# EAGLE design amp (EAGLE 5.07)
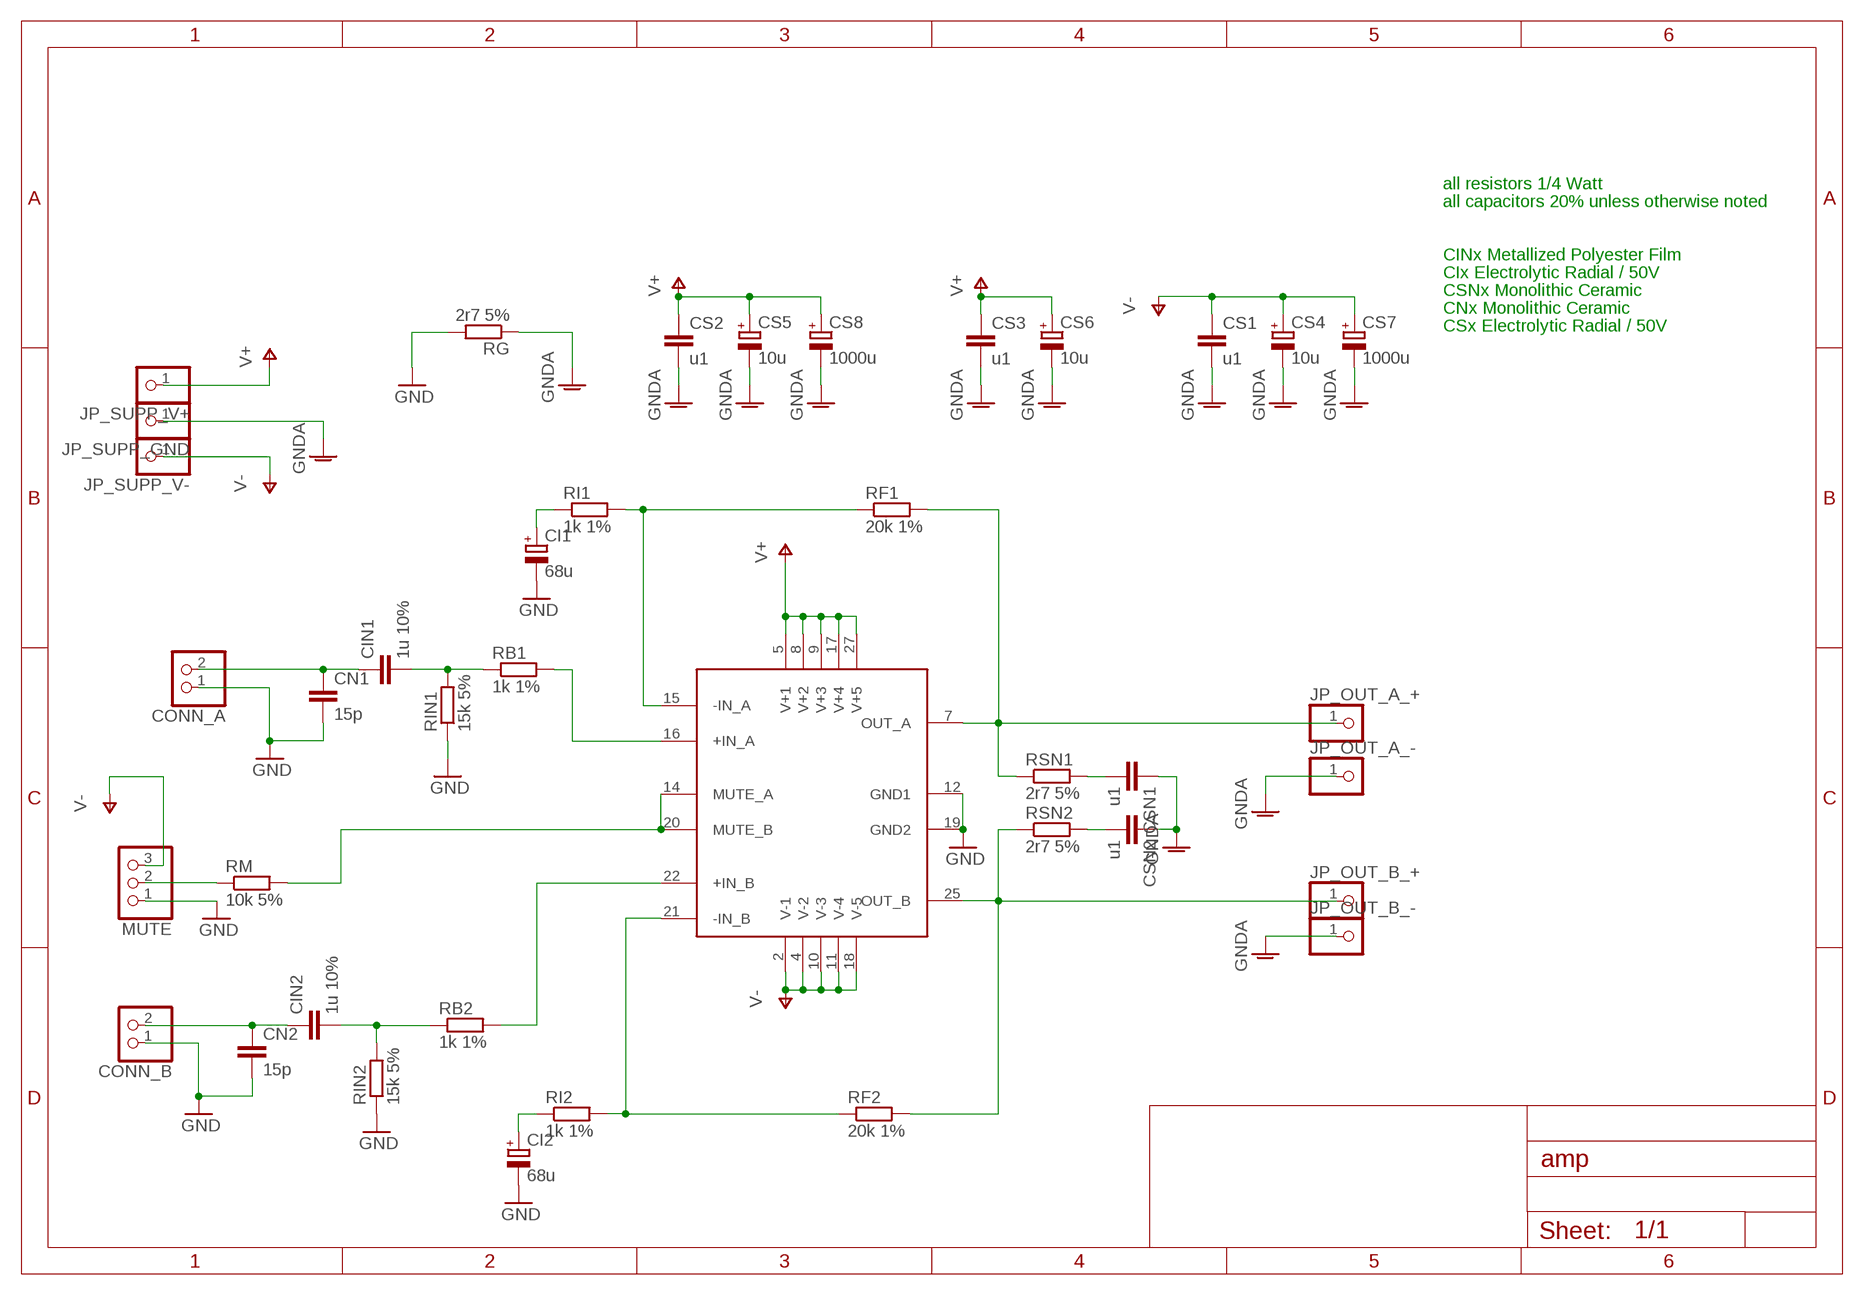
[diagram p0: schematic, sheet 1]

## Parts
CI1  68u  CPOL-EUE2.5-7  [E2,5-7]
CI2  68u  CPOL-EUE2.5-7  [E2,5-7]
CIN1  1u 10%  C-EU050-025X075  [C050-025X075]
CIN2  1u 10%  C-EU050-025X075  [C050-025X075]
CN1  15p  C-EU050-024X044  [C050-024X044]
CN2  15p  C-EU050-024X044  [C050-024X044]
CONN_A  PINHD-1X2  [1X02]
CONN_B  PINHD-1X2  [1X02]
CS1  u1  C-EU025-030X050  [C025-030X050]
CS2  u1  C-EU025-030X050  [C025-030X050]
CS3  u1  C-EU025-030X050  [C025-030X050]
CS4  10u  CPOL-EUE2-5  [E2-5]
CS5  10u  CPOL-EUE2-5  [E2-5]
CS6  10u  CPOL-EUE2-5  [E2-5]
CS7  1000u  CPOL-EUE5-13  [E5-13]
CS8  1000u  CPOL-EUE5-13  [E5-13]
CSN1  u1  C-EU025-030X050  [C025-030X050]
CSN2  u1  C-EU025-030X050  [C025-030X050]
JP_OUT_A_+  PINHD-1X1  [1X01]
JP_OUT_A_-  PINHD-1X1  [1X01]
JP_OUT_B_+  PINHD-1X1  [1X01]
JP_OUT_B_-  PINHD-1X1  [1X01]
JP_SUPP_GND  PINHD-1X1  [1X01]
JP_SUPP_V+  PINHD-1X1  [1X01]
JP_SUPP_V-  PINHD-1X1  [1X01]
MUTE  PINHD-1X3  [1X03]
RB1  1k 1%  R-EU_0204/7  [0204/7]
RB2  1k 1%  R-EU_0204/7  [0204/7]
RF1  20k 1%  R-EU_0204/7  [0204/7]
RF2  20k 1%  R-EU_0204/7  [0204/7]
RG  2r7 5%  R-EU_0204/7  [0204/7]
RI1  1k 1%  R-EU_0204/7  [0204/7]
RI2  1k 1%  R-EU_0204/7  [0204/7]
RIN1  15k 5%  R-EU_0207/7  [0207/7]
RIN2  15k 5%  R-EU_0204/7  [0204/7]
RM  10k 5%  R-EU_0204/5  [0204/5]
RSN1  2r7 5%  R-EU_0204/5  [0204/5]
RSN2  2r7 5%  R-EU_0204/5  [0204/5]
U$1  L4780TA  LM4780TA  [TO-220_27]

## Nets
GND [low_gnd]: CI1.- CI2.- CN1.2 CN2.2 CONN_A.1 CONN_B.1 MUTE.1 RG.2 RIN1.1 RIN2.1 U$1.12(GND1) U$1.19(GND2)
GNDA [power]: CS1.2 CS2.2 CS3.2 CS4.- CS5.- CS6.- CS7.- CS8.- CSN1.1 CSN2.1 JP_OUT_A_-.1 JP_OUT_B_-.1 JP_SUPP_GND.1 RG.1
N$1: MUTE.2 RM.1
N$3 [audio_in]: CIN1.2 RB1.1 RIN1.2
N$4 [audio_in]: CIN1.1 CN1.1 CONN_A.2
N$5 [audio_in]: RB1.2 U$1.16(+IN_A)
N$6 [audio_in]: CIN2.2 RB2.1 RIN2.2
N$7 [audio_in]: CIN2.1 CN2.1 CONN_B.2
N$9: CSN1.2 RSN1.2
N$11: CI2.+ RI2.1
N$12: RF2.1 RI2.2 U$1.21(-IN_B)
N$14: CSN2.2 RSN2.2
N$17: CI1.+ RI1.1
N$18: RF1.1 RI1.2 U$1.15(-IN_A)
N_AUDIO_IN_B [audio_in]: RB2.2 U$1.22(+IN_B)
N_MUTE: RM.2 U$1.14(MUTE_A) U$1.20(MUTE_B)
N_OUT_A [audio_out]: JP_OUT_A_+.1 RF1.2 RSN1.1 U$1.7(OUT_A)
N_OUT_B [audio_out]: JP_OUT_B_+.1 RF2.2 RSN2.1 U$1.25(OUT_B)
V+ [power]: CS2.1 CS3.1 CS5.+ CS6.+ CS8.+ JP_SUPP_V+.1 U$1.5(V+1) U$1.8(V+2) U$1.9(V+3) U$1.17(V+4) U$1.27(V+5)
V- [power]: CS1.1 CS4.+ CS7.+ JP_SUPP_V-.1 MUTE.3 U$1.2(V-1) U$1.4(V-2) U$1.10(V-3) U$1.11(V-4) U$1.18(V-5)

## Notes on the sheet
- all resistors 1/4 Watt
- all capacitors 20% unless otherwise noted
- CINx Metallized Polyester Film
- CIx Electrolytic Radial / 50V
- CSNx Monolithic Ceramic
- CNx Monolithic Ceramic
- CSx Electrolytic Radial / 50V

## Library data of the parts
CI1 CI2 CS4-CS8 = resistor:CPOL-EU: POLARIZED CAPACITOR, European symbol
CIN1 CIN2 CN1 CN2 CS1-CS3 CSN1 CSN2 = resistor:C-EU: CAPACITOR, European symbol
CONN_A CONN_B = pinhead:PINHD-1X2: PIN HEADER
JP_OUT_A_+ JP_OUT_A_- JP_OUT_B_+ JP_OUT_B_- JP_SUPP_GND JP_SUPP_V+ JP_SUPP_V- = pinhead:PINHD-1X1: PIN HEADER
MUTE = pinhead:PINHD-1X3: PIN HEADER
RB1 RB2 RF1 RF2 RG RI1 RI2 RIN1 RIN2 RM RSN1 RSN2 = resistor:R-EU_: RESISTOR, European symbol
U$1 = mru-lib:LM4780TA: National Semiconductor LM4780 Overture Audio Power Amplifier Series TO220 27 Lead Package

## Net classes
1 power: width 1.778 mm
2 audio_in: width 0.508 mm
3 audio_out: width 1.27 mm

## Board
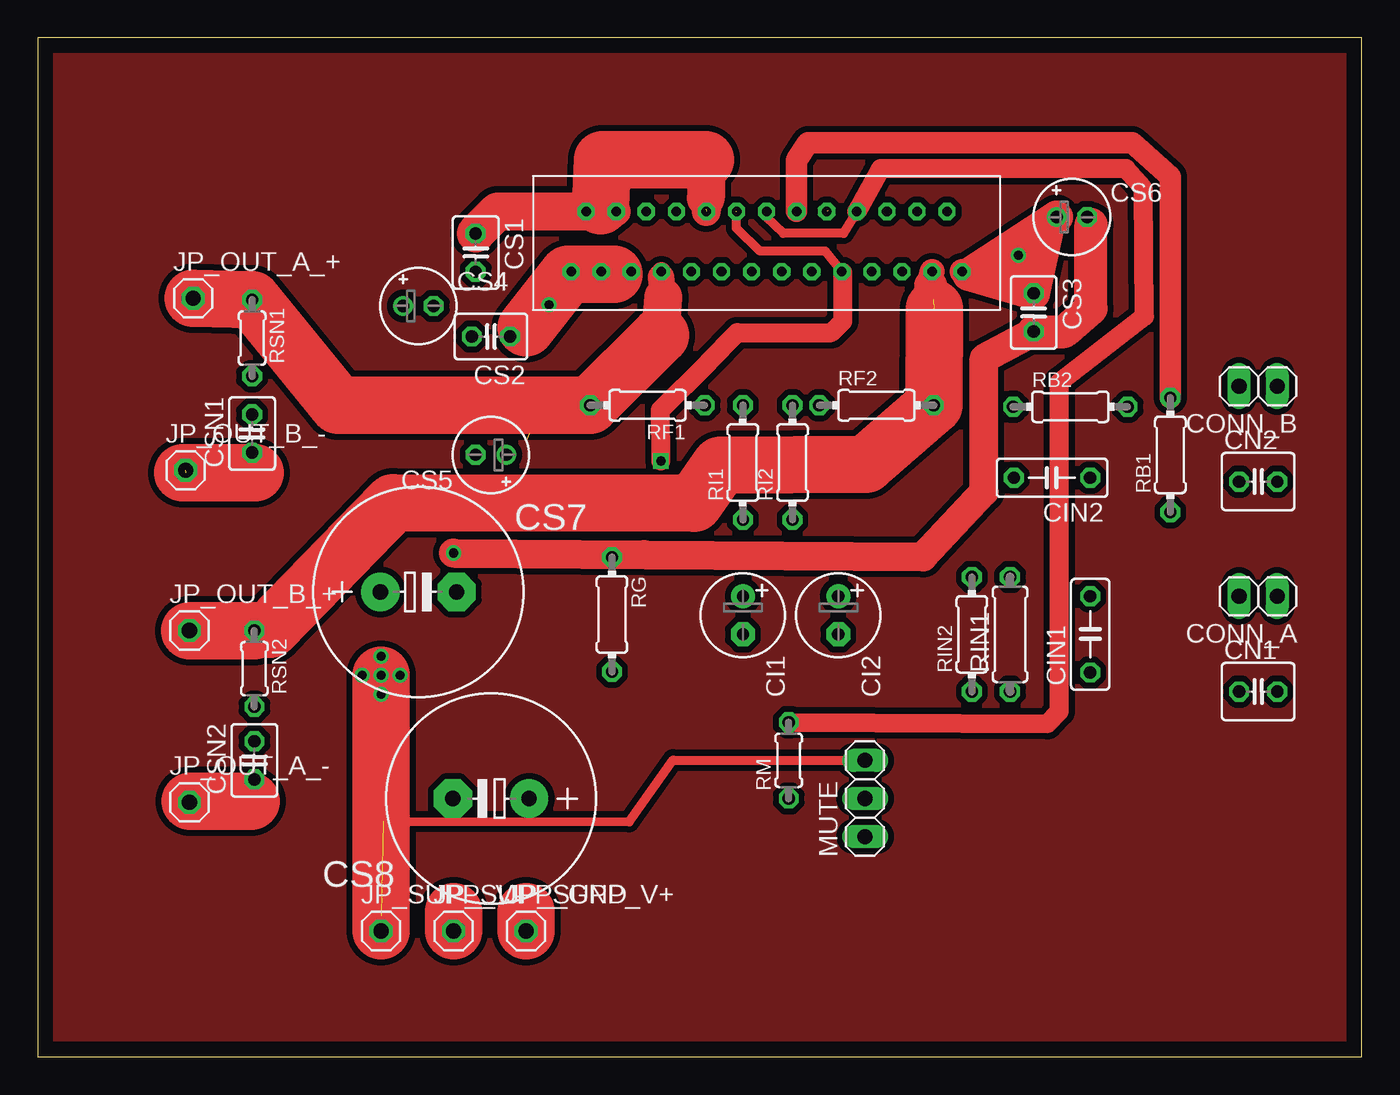
[diagram p1: board, top side]
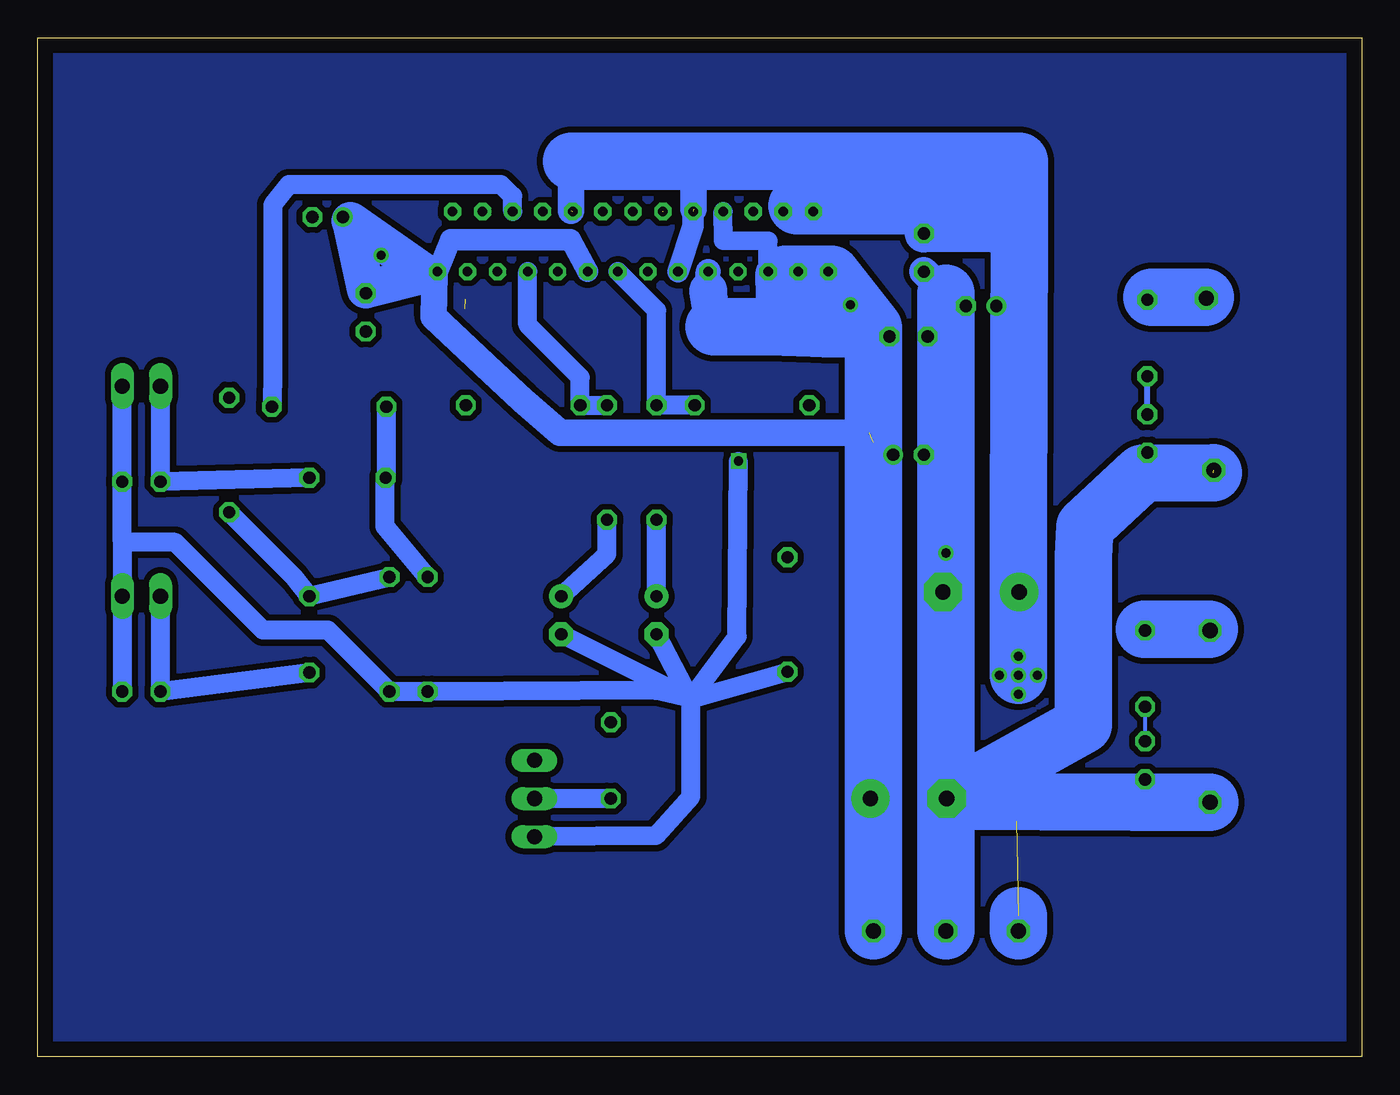
[diagram p2: board, bottom side, seen from below]

Size 88.14 x 67.82 mm. Coordinates in mm from the lower left corner, seen from the top.
Outline: 0,0 88.14,0 88.14,67.82 0,67.82 0,0
Copper layers (1*16): Top 0.035mm / dielectric 1.5mm / Bottom 0.035mm
Design rules "default": minimum track width 10mil, minimum drill 24mil, track to track 8mil, track to pad 8mil, pad to pad 8mil, via to via 8mil, smd to smd 8mil, copper to edge 40mil, drill to drill 8mil, minimum pad ring 10mil, minimum via ring 8mil, stop-mask expansion 4mil, vias tented up to drill 0mil, thermal gap 10mil

### Footprints (pad centres in the part's own frame; a part is rotated, then mirrored left to right if it is on the bottom)
E2,5-6 = drill 0.813 pad 1.6 round: + -1.27,0 | drill 0.813 pad 1.6 octagon: - 1.27,0
C050-025X075 = drill 0.813 octagon: 1 -2.54,0; 2 2.54,0
C025-040X050 = drill 0.813 octagon: 1 -1.27,0; 2 1.27,0
1X02 = drill 1.016 long: 1 -1.27,0; 2 1.27,0
C025-030X050 = drill 0.813 octagon: 1 -1.27,0; 2 1.27,0
E2-5 = drill 0.813 pad 1.27 round: + -1.016,0 | drill 0.813 pad 1.27 octagon: - 1.016,0
E5-13 = drill 1.016 pad 2.54 round: + -2.54,0 | drill 1.016 pad 2.54 octagon: - 2.54,0
1X01 = drill 1.016 octagon: 1 0,0
1X03 = drill 1.016 long: 1 -2.54,0; 2 0,0; 3 2.54,0
0204/7 = drill 0.813 octagon: 1 -3.81,0; 2 3.81,0
0207/7 = drill 0.813 octagon: 1 -3.81,0; 2 3.81,0
0204/5 = drill 0.813 octagon: 1 -2.54,0; 2 2.54,0
TO-220_27 = drill 0.635 octagon: 1 0,0; 2 1.001,4.003; 3 2.002,0; 4 3.002,4.003; 5 4.003,0; 6 5.004,4.003; 7 6.005,0; 8 7.005,4.003; 9 8.006,0; 10 9.007,4.003; 11 10.008,0; 12 11.008,4.003; 13 12.009,0; 14 13.01,4.003; 15 14.011,0; 16 15.011,4.003; 17 16.012,0; 18 17.013,4.003; 19 18.014,0; 20 19.014,4.003; 21 20.015,0; 22 21.016,4.003; 23 22.017,0; 24 23.017,4.003; 25 24.018,0; 26 25.019,4.003; 27 26.015,0

### Placement (x,y rotation side)
CI1  68u  [E2,5-6]  46.94,29.39 270 top
CI2  68u  [E2,5-6]  53.29,29.39 270 top
CIN1  70.05,28.12 90 top
CIN2  67.51,38.53 180 top
CN1  15p  [C025-040X050]  81.23,24.31 0 top
CN2  15p  [C025-040X050]  81.23,38.28 0 top
CONN_A  81.23,30.66 180 top
CONN_B  81.23,44.63 180 top
CS1  29.16,53.52 270 top
CS2  30.18,47.93 180 top
CS3  66.29,49.53 270 top
CS4  25.35,49.96 0 top
CS5  30.18,40.06 180 top
CS6  68.83,55.88 0 top
CS7  25.35,30.94 0 top
CS8  30.18,17.2 180 top
CSN1  14.27,41.48 90 top
CSN2  14.43,19.74 90 top
JP_OUT_A_+  10.36,50.47 0 top
JP_OUT_A_-  10.11,16.94 0 top
JP_OUT_B_+  10.11,28.37 0 top
JP_OUT_B_-  9.86,39.04 0 top
JP_SUPP_GND  27.69,8.38 0 top
JP_SUPP_V+  32.51,8.38 0 top
JP_SUPP_V-  22.86,8.38 0 top
MUTE  55.07,17.2 90 top
RB1  75.39,40.06 90 top
RB2  68.73,43.26 0 top
RF1  40.59,43.36 180 top
RF2  55.83,43.36 0 top
RG  38.23,29.44 270 top
RI1  46.94,39.55 90 top
RI2  50.24,39.55 90 top
RIN1  64.72,28.12 90 top
RIN2  62.18,28.12 90 top
RM  49.99,19.74 90 top
RSN1  14.27,47.83 270 top
RSN2  14.43,25.83 270 top
U$1  35.51,52.25 0 top

### Tracks (layer width: path | path; a pad name or v marks a point on that pad's centre or on a via)
GND  (via drill 0.6)  (1 unrouted)
  Top 0.406: 49.43,48.16 46.53,48.16 46.56,48.18 | 53.59,52.18 U$1.19
  Top 0.61: U$1.19 52.43,53.62 48.08,53.62 46.51,55.14 46.51,56.24
  Top 1.27: 46.53,48.16 44.63,46.18 41.45,43.05 v41.48,39.65 | 46.56,48.18 52.83,48.18 53.59,48.95 53.59,52.18
  Bottom 0.406: 82.45,34.24 82.5,34.29 | 41.5,39.62 v41.48,39.65
  Bottom 0.61: 44.65,23.8 44.68,23.8 44.68,23.85
  Bottom 1.27: CN1.2 CONN_A.1 82.5,34.29 CN2.2 CONN_B.1 | 44.68,23.8 CI1.- | 44.68,23.8 RG.2 | MUTE.1 46.99,14.73 44.65,17.32 44.65,23.8 CI2.- | 44.68,23.85 46.99,24.38 RIN2.1 RIN1.1 68.81,28.4 73.13,28.4 78.97,34.24 82.45,34.24 | 44.68,23.8 41.58,27.96 41.5,39.62
GNDA  (via drill 0.6)  (1 unrouted)
  Top 0.61: 70.1,55.37 CS6.- | 40.39,33.42 RG.1
  Top 1.93: CS3.2 62.99,46.48 62.99,37.59 58.93,33.27 40.39,33.42 v27.69,33.53
  Top 2.184: CS3.2 68.33,48.26 70.1,49.78 70.1,55.37
  Top 3.81: JP_SUPP_GND.1 27.69,9.65
  Bottom 0.406: 27.69,40.64 CS5.- | 27.69,31.75 CS7.- | 27.69,21.08 CS8.- | 14.48,16.94 CSN2.1
  Bottom 0.61: JP_OUT_B_-.1 CSN1.1 | 27.69,50.29 CS4.- | 27.69,49.78 CS2.2
  Bottom 1.93: 27.69,50.8 CS1.2
  Bottom 3.81: 9.91,38.86 14.63,38.84 18.44,35.28 18.54,33.27 18.54,22.1 27.69,17.02 | 27.69,17.02 JP_SUPP_GND.1 | 27.69,17.02 27.69,21.08 27.69,31.75 v27.69,33.53 27.69,40.64 27.69,49.78 27.69,50.29 27.69,50.8 | JP_OUT_A_-.1 14.48,16.94 15.16,16.94 27.69,17.02
N$1
  Bottom 1.27: RM.1 MUTE.2
N$2
  Bottom 3.81: 22.86,56.64 37.59,56.64
N$3
  Bottom 1.27: RIN1.2 CIN1.2 71.07,31.93 RB1.1
N$4
  Bottom 1.27: CONN_A.2 CN1.1 CIN1.1
N$5
  Top 1.422: RB1.2 75.39,58.57 72.87,60.83 51.28,60.83 50.52,59.66 U$1.16
N$6
  Bottom 1.27: RIN2.2 65.02,35.31 65.02,38.53 CIN2.2 64.92,38.48 RB2.1
N$7
  Bottom 1.27: CONN_B.2 CN2.1 CIN2.1
N$8
  Top 3.81: 32.51,48.51 35.31,52.07 38.35,52.07
N$9
  Bottom 0.406: CSN1.2 RSN1.2
N$10
  Bottom 2.54: 62.23,52.07 67.31,55.63 66.29,51.05 62.23,52.07
N$11
  Bottom 1.27: CI2.+ 50.24,33.45 RI2.1
N$12
  Bottom 1.27: U$1.21 55.52,48.72 52.02,45.21 RF2.1 RI2.2
N$13
  Bottom 3.81: 32.51,48.51 35.31,52.07 38.35,52.07
N$14
  Bottom 0.254: CSN2.2 RSN2.2
N$15  (via drill 0.6)
  other vias: 34.04,50.04
N$16  (via drill 0.6)
  other vias: 65.28,53.34
N$17
  Bottom 1.27: CI1.+ RI1.1
N$18
  Bottom 1.27: RF1.1 RI1.2 46.94,49.67 U$1.15
N$19  (via drill 0.6)
  other vias: 24.13,25.4
N$20  (via drill 0.6)
  other vias: 21.59,25.4
N$21  (via drill 0.6)
  other vias: 22.86,26.67
N$22
  Bottom 3.81: 10.41,50.55 13.97,50.55
N$23
  Bottom 3.81: 10.16,28.45 14.48,28.45
N$24
  Top 3.81: 9.65,38.86 14.48,38.86
N$25
  Top 3.81: 10.16,17.02 14.22,17.02
N$26
  pour Bottom (isolate 0.406, no thermals): 0.25,67.56 87.88,67.56 87.88,0.25 0.25,0.25
N$27
  pour Top (isolate 0.406, no thermals): 0.25,67.56 0.25,0.25 87.88,0.25 87.88,67.56
N_AUDIO_IN_B
  Bottom 1.27: U$1.22 56.52,57.28 57.3,58.04 71.42,58.04 72.49,56.69 72.49,45.74 RB2.2
N_MUTE
  Top 0.61: U$1.14 48.51,55.88 49.63,54.79 53.65,54.79 U$1.20
  Top 1.27: U$1.20 56.11,59.11 72.44,59.11 73.58,57.78 73.66,49.28 68,44.88 68,22.99 67.21,22.17 RM.2
N_OUT_A
  Top 1.27: 41.48,51.87 U$1.7
  Top 1.778: 41.66,50.55 41.48,51.87
  Top 2.54: 41.45,48.01 41.66,50.55
  Top 3.81: JP_OUT_A_+.1 RSN1.1 20.02,43.36 RF1.2 41.45,48.01
N_OUT_B  (1 unrouted)
  Top 1.676: 59.44,51.31 U$1.25
  Top 2.184: 59.66,50.42 59.44,51.31 | RSN2.1 15.49,28.45
  Top 3.81: JP_OUT_B_+.1 RSN2.1 | 15.49,28.45 23.67,36.88 43.69,36.83 45.47,39.37 55.14,39.42 RF2.2 59.69,49.78
V+  (1 unrouted)
  Top 1.422: 64.85,52.25 CS3.1
  Top 1.676: U$1.27 61.98,52.07
  Top 2.184: 67.31,55.37 66.29,54.61 CS3.1 | 67.31,55.37 CS6.+ 61.98,52.07 | 61.98,52.07 64.85,52.25 | 61.98,52.07 CS3.1 | CS3.1 67.31,55.37
  Top 3.81: 32.51,9.65 JP_SUPP_V+.1
  Bottom 0.406: 32.51,40.89 CS5.+ | 32.51,21.08 CS8.+
  Bottom 0.61: 51.52,52.28 U$1.17
  Bottom 1.27: U$1.5 39.52,54.28 42.49,54.3 U$1.8
  Bottom 1.422: 61.72,52.07 U$1.27 60.66,54.36 52.65,54.36 51.52,52.28
  Bottom 1.676: 32.51,48.44 CS2.1 | 39.46,48.56 U$1.5 | 43.52,50.98 U$1.9
  Bottom 1.778: 61.72,52.07 61.77,49.25 58.37,46.02 55.85,43.69 53.37,41.53 32.77,41.53
  Bottom 2.54: 43.13,48.56 43.52,50.98
  Bottom 3.81: 43.13,48.56 39.46,48.56 35.7,48.44 32.51,48.44 32.51,40.89 32.51,21.08 JP_SUPP_V+.1
V-  (via drill 0.6)  (3 unrouted)
  Top 0.406: 42.29,19.76 42.32,19.74
  Top 0.61: 42.29,19.76 39.37,15.65 22.99,15.67 | 42.32,19.74 MUTE.3
  Top 1.93: 44.48,57.15 U$1.10 | 37.45,56.65 U$1.4 U$1.2
  Top 2.54: 44.45,59.69 44.48,57.15 | U$1.2 30.62,56.25 CS1.1
  Top 3.81: JP_SUPP_V-.1 v22.86,24.13 v22.86,25.4 | 44.45,59.69 37.59,59.69 37.45,56.65
  Bottom 0.406: 22.82,48.51 CS4.+ | 22.85,31.75 CS7.+ | 22.81,54.61 24.56,54.79
  Bottom 1.422: U$1.11 44.52,55.28 U$1.10
  Bottom 1.778: 44.48,56.39 44.5,58.57 | 52.6,59.59 52.63,56.29
  Bottom 2.54: 24.56,54.79 CS1.1
  Bottom 3.81: v22.86,25.4 22.85,31.75 22.82,48.51 22.81,53.14 22.81,54.61 22.81,59.59 52.6,59.59 | JP_SUPP_V-.1 22.86,9.4